# EAGLE design teensy_mother_board (EAGLE 7.5.0)
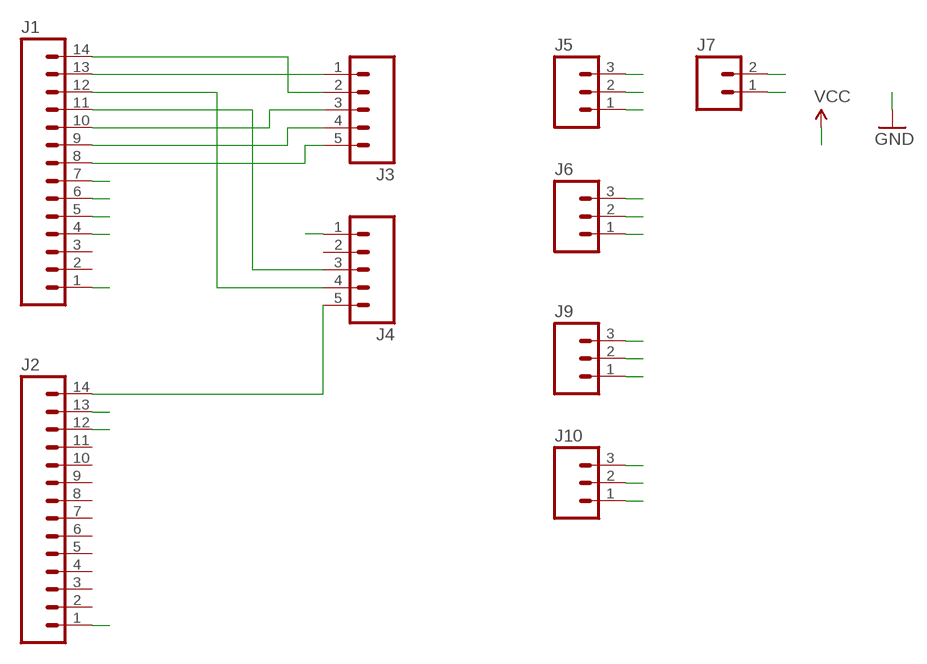
[diagram p0: schematic, sheet 1]

## Parts
J1  M14  [1X14]
J2  M14  [1X14]
J3  M05PTH  [1X05]
J4  M05PTH  [1X05]
J5  M03PTH  [1X03]
J6  M03PTH  [1X03]
J7  M02JST-PTH-VERT  [JST-2-PTH-VERT]
J9  M03PTH  [1X03]
J10  M03PTH  [1X03]

## Nets
GND: J1.1 J4.1 J6.2 J7.1 J10.2
IN_SER: J1.14 J3.2
MASTER_MUX1_IN: J2.13 J5.2
MASTER_MUX2_IN: J2.12 J9.2
MASTER_MUX_A: J1.7 J5.1 J9.1
MASTER_MUX_B: J1.6 J6.1 J10.1
MASTER_MUX_C: J1.5 J6.3 J10.3
MASTER_MUX_D: J1.4 J5.3 J9.3
OUT_SER: J1.13 J3.1
SCK_CLK: J2.14 J4.5
SH_LD: J1.11 J4.3
SLAVE_MUX_A: J1.10 J3.3
SLAVE_MUX_B: J1.9 J3.4
SLAVE_MUX_C: J1.8 J3.5
SS: J1.12 J4.4
VCC: J2.1 J7.2
Unconnected: J1.2 J1.3 J2.2 J2.3 J2.4 J2.5 J2.6 J2.7 J2.8 J2.9 J2.10 J2.11 J4.2

## Library data of the parts
J1 J2 = SparkFun-Connectors:M14: Header 14 Standard 14-pin 0.1" header. Use with straight break away headers (SKU : PRT-00116), right angle break away headers (PRT-00553), swiss pins (PRT-00743), machine pins (PRT-00117), and female headers (PRT-00115).
J3 J4 = SparkFun-Connectors:M05: Header 5 Standard 5-pin 0.1" header. Use with straight break away headers (SKU : PRT-00116), right angle break away headers (PRT-00553), swiss pins (PRT-00743), machine pins (PRT-00117), and female headers (PRT-00115). Molex polarized connector foot print use with SKU : PRT-08230 with associated crimp pins and housings.
J5 J6 J9 J10 = SparkFun-Connectors:M03: Header 3 Standard 3-pin 0.1" header. Use with straight break away headers (SKU : PRT-00116), right angle break away headers (PRT-00553), swiss pins (PRT-00743), machine pins (PRT-00117), and female headers (PRT-00115). Molex polarized connector foot print use with SKU : PRT-08232 with associated crimp pins and housings.
J7 = SparkFun-Connectors:M02: Standard 2-pin 0.1" header. Use with - straight break away headers ( PRT-00116) - right angle break away headers (PRT-00553) - swiss pins (PRT-00743) - machine pins (PRT-00117) - female headers (PRT-00115) Molex polarized connector foot print use with: PRT-08233 with associated crimp pins and housings. 2.54_SCREWTERM for use with PRT-10571. 3.5mm Screw Terminal footprints for PRT-08084 5mm Screw Terminal footprints for use with PRT-08432

## Board
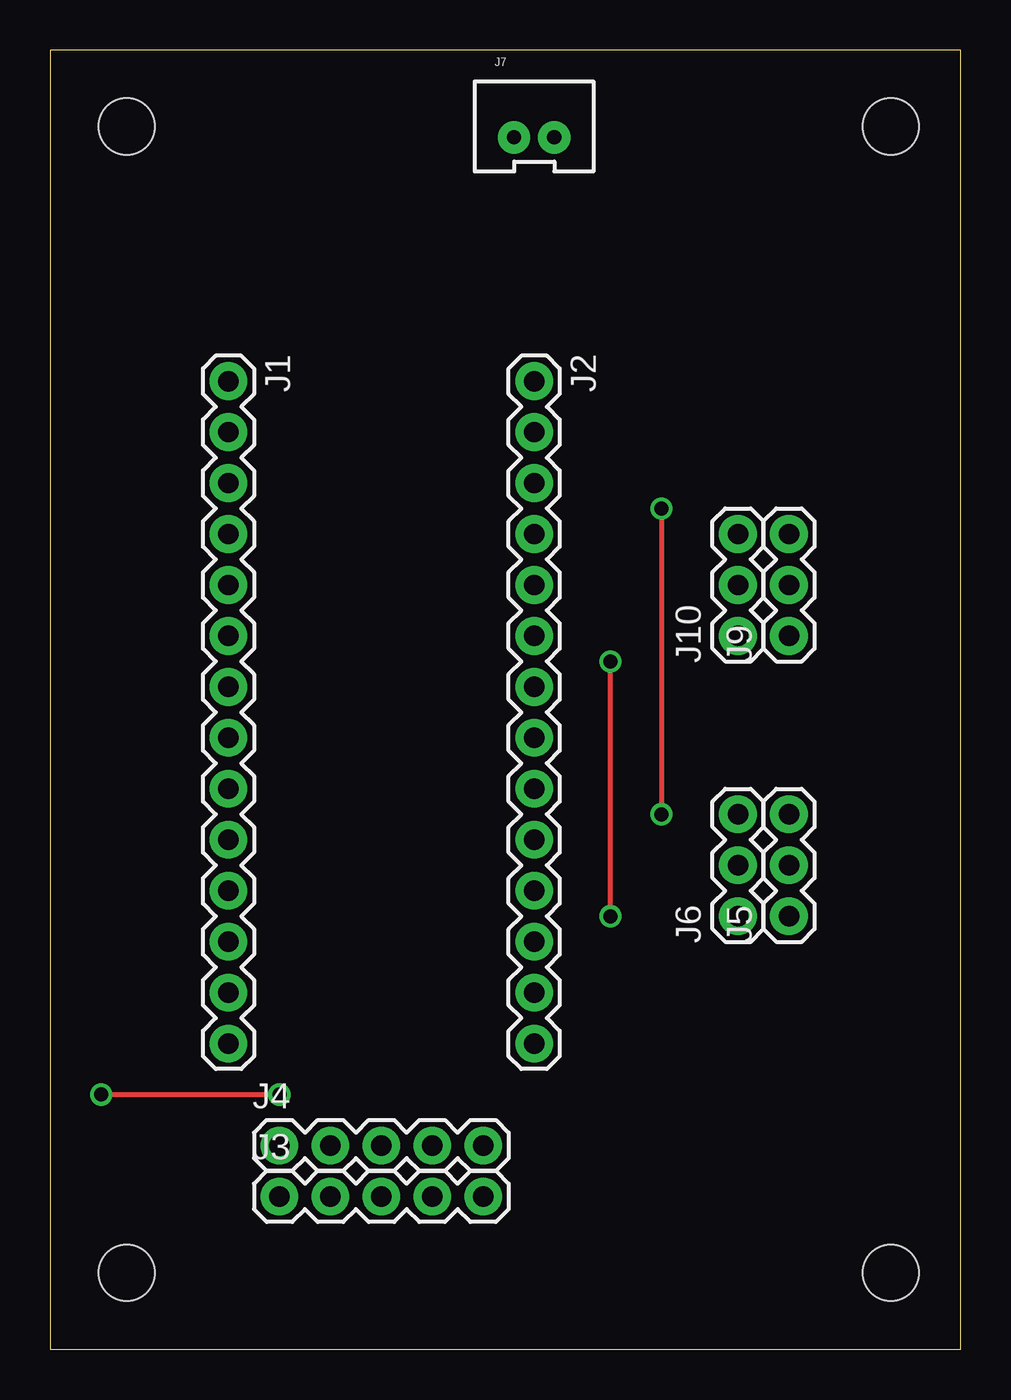
[diagram p1: board, top side]
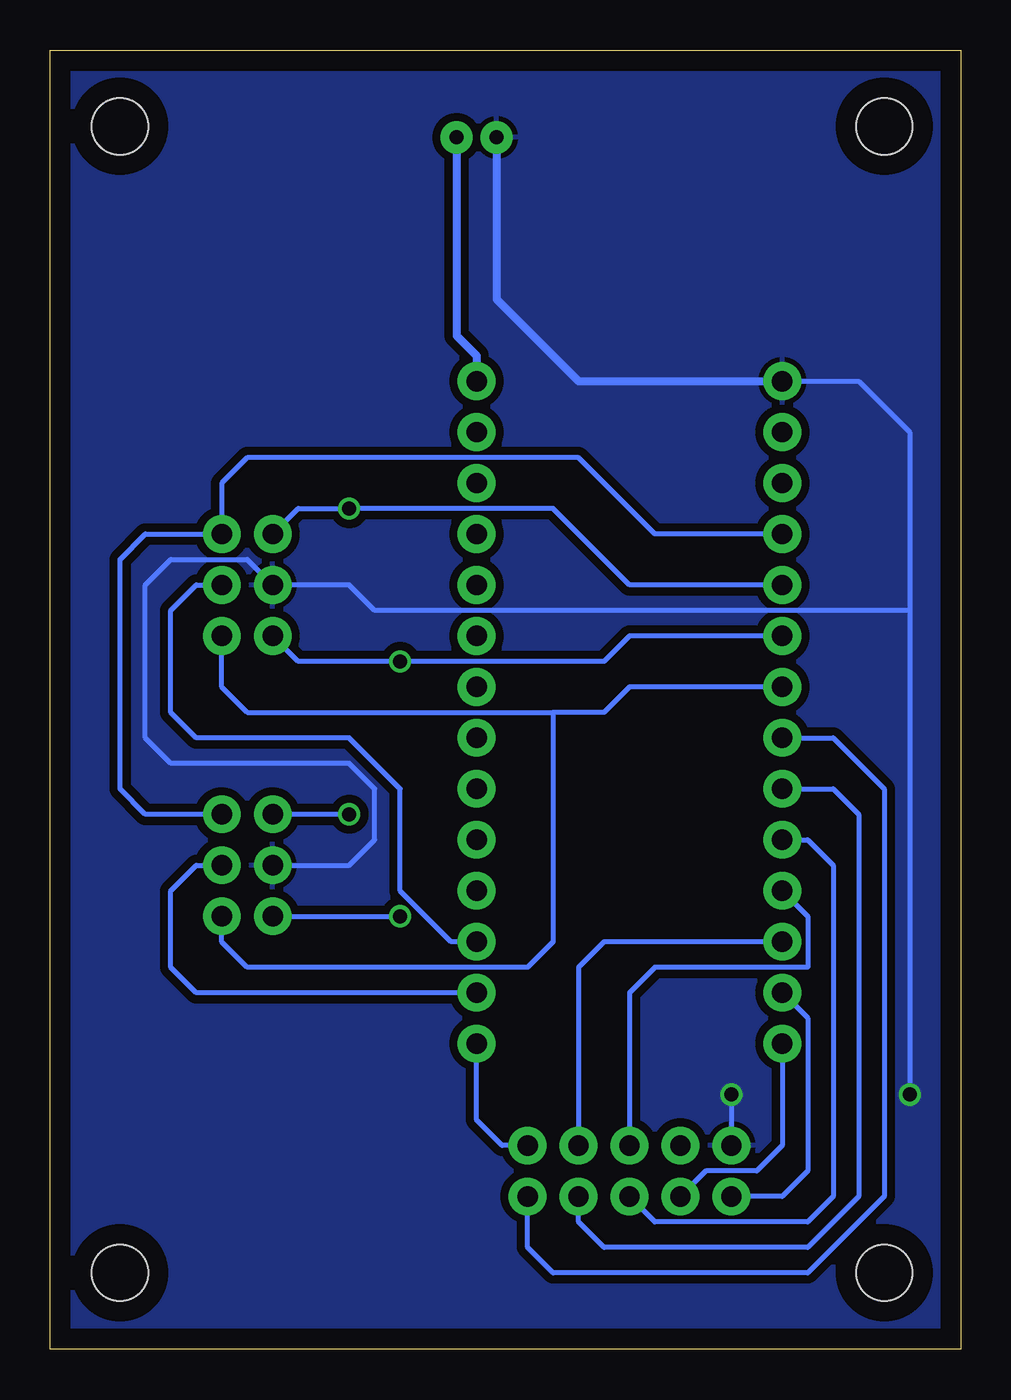
[diagram p2: board, bottom side, seen from below]

Size 45.39 x 64.76 mm. Coordinates in mm from the lower left corner, seen from the top.
Outline: 0,0 45.39,0 45.39,64.76 0,64.76 0,0
Copper layers (1*16): Top 0.035mm / dielectric 1.5mm / Bottom 0.035mm
Design rules "default": minimum track width 10mil, minimum drill 24mil, track to track 8mil, track to pad 8mil, pad to pad 8mil, via to via 8mil, smd to smd 8mil, copper to edge 40mil, drill to drill 8mil, minimum pad ring 10mil, minimum via ring 8mil, stop-mask expansion 4mil, vias tented up to drill 0mil, thermal gap 10mil
Holes 2.8 mm at 3.81,3.81 41.91,3.81 3.81,60.96 41.91,60.96

### Footprints (pad centres in the part's own frame; a part is rotated, then mirrored left to right if it is on the bottom)
1X14 = drill 1.016 pad 1.88: 1 0,0; 2 2.54,0; 3 5.08,0; 4 7.62,0; 5 10.16,0; 6 12.7,0; 7 15.24,0; 8 17.78,0; 9 20.32,0; 10 22.86,0; 11 25.4,0; 12 27.94,0; 13 30.48,0; 14 33.02,0
1X05 = drill 1.016 pad 1.88: 1 0,0; 2 2.54,0; 3 5.08,0; 4 7.62,0; 5 10.16,0
1X03 = drill 1.016 pad 1.88: 1 0,0; 2 2.54,0; 3 5.08,0
JST-2-PTH-VERT = drill 0.7 pad 1.6: 1 -1,-0.55; 2 1,-0.55

### Placement (x,y rotation side)
J1  8.89,48.26 270 top
J2  24.13,48.26 270 top
J3  11.43,7.62 0 top
J4  11.43,10.16 0 top
J5  36.83,21.59 90 top
J6  34.29,21.59 90 top
J7  24.13,60.96 0 top
J9  36.83,35.56 90 top
J10  34.29,35.56 90 top

### Tracks (layer width: path | path; a pad name or v marks a point on that pad's centre or on a via)
GND  (via drill 0.7 pad 0.61)
  Top 0.254: v2.54,12.7 v11.43,12.7
  Bottom 0.254: J6.2 30.48,24.13 29.21,25.4 29.21,27.94 30.48,29.21 39.37,29.21 40.64,30.48 40.64,38.1 39.37,39.37 35.56,39.37 J10.2 30.48,38.1 29.21,36.83 2.54,36.83 | 2.54,36.83 v2.54,12.7 | v11.43,12.7 J4.1 | 19.05,48.26 5.08,48.26 2.54,45.72 2.54,36.83
  Bottom 0.406: J7.1 23.13,52.34 19.05,48.26 J1.1
  pour Bottom (isolate 0.406): 0,0 0,64.77 45.72,64.77 45.72,0
IN_SER
  Bottom 0.254: J1.14 8.89,10.16 10.16,8.89 12.7,8.89 J3.2
MASTER_MUX1_IN
  Bottom 0.254: J2.13 38.1,17.78 39.37,19.05 39.37,22.86 38.1,24.13 J5.2
MASTER_MUX2_IN
  Bottom 0.254: J2.12 25.4,20.32 27.94,22.86 27.94,27.94 30.48,30.48 38.1,30.48 39.37,31.75 39.37,36.83 38.1,38.1 J9.2
MASTER_MUX_A
  Bottom 0.254: J1.7 16.51,33.02 17.78,31.75 20.32,31.75 | J9.1 36.83,33.02 35.56,31.75 20.32,31.75 | 20.32,31.75 20.32,20.32 21.59,19.05 35.56,19.05 36.83,20.32 J5.1
MASTER_MUX_B  (via drill 0.7 pad 0.61)
  Top 0.254: v27.94,21.59 v27.94,34.29
  Bottom 0.254: J1.6 16.51,35.56 17.78,34.29 v27.94,34.29 33.02,34.29 J10.1 | J6.1 v27.94,21.59
MASTER_MUX_C  (via drill 0.7 pad 0.61)
  Top 0.254: v30.48,41.91 v30.48,26.67
  Bottom 0.254: J1.5 16.51,38.1 20.32,41.91 v30.48,41.91 33.02,41.91 J10.3 | v30.48,26.67 J6.3
MASTER_MUX_D
  Bottom 0.254: J1.4 15.24,40.64 19.05,44.45 35.56,44.45 36.83,43.18 J9.3 40.64,40.64 41.91,39.37 41.91,27.94 40.64,26.67 J5.3
OUT_SER
  Bottom 0.254: J1.13 7.62,16.51 7.62,8.89 8.89,7.62 J3.1
SCK_CLK
  Bottom 0.254: J4.5 22.86,10.16 24.13,11.43 J2.14
SH_LD
  Bottom 0.254: J1.11 7.62,21.59 7.62,19.05 15.24,19.05 16.51,17.78 J4.3
SLAVE_MUX_A
  Bottom 0.254: J1.10 7.62,25.4 6.35,24.13 6.35,7.62 7.62,6.35 15.24,6.35 J3.3
SLAVE_MUX_B
  Bottom 0.254: J1.9 6.35,27.94 5.08,26.67 5.08,7.62 7.62,5.08 17.78,5.08 19.05,6.35 J3.4
SLAVE_MUX_C
  Bottom 0.254: J1.8 6.35,30.48 3.81,27.94 3.81,7.62 7.62,3.81 20.32,3.81 21.59,5.08 J3.5
SS
  Bottom 0.254: J1.12 17.78,20.32 19.05,19.05 J4.4
VCC
  Bottom 0.406: J7.2 25.13,50.53 24.13,49.53 J2.1